# Altium project allaki_mezzanine.PrjPCB
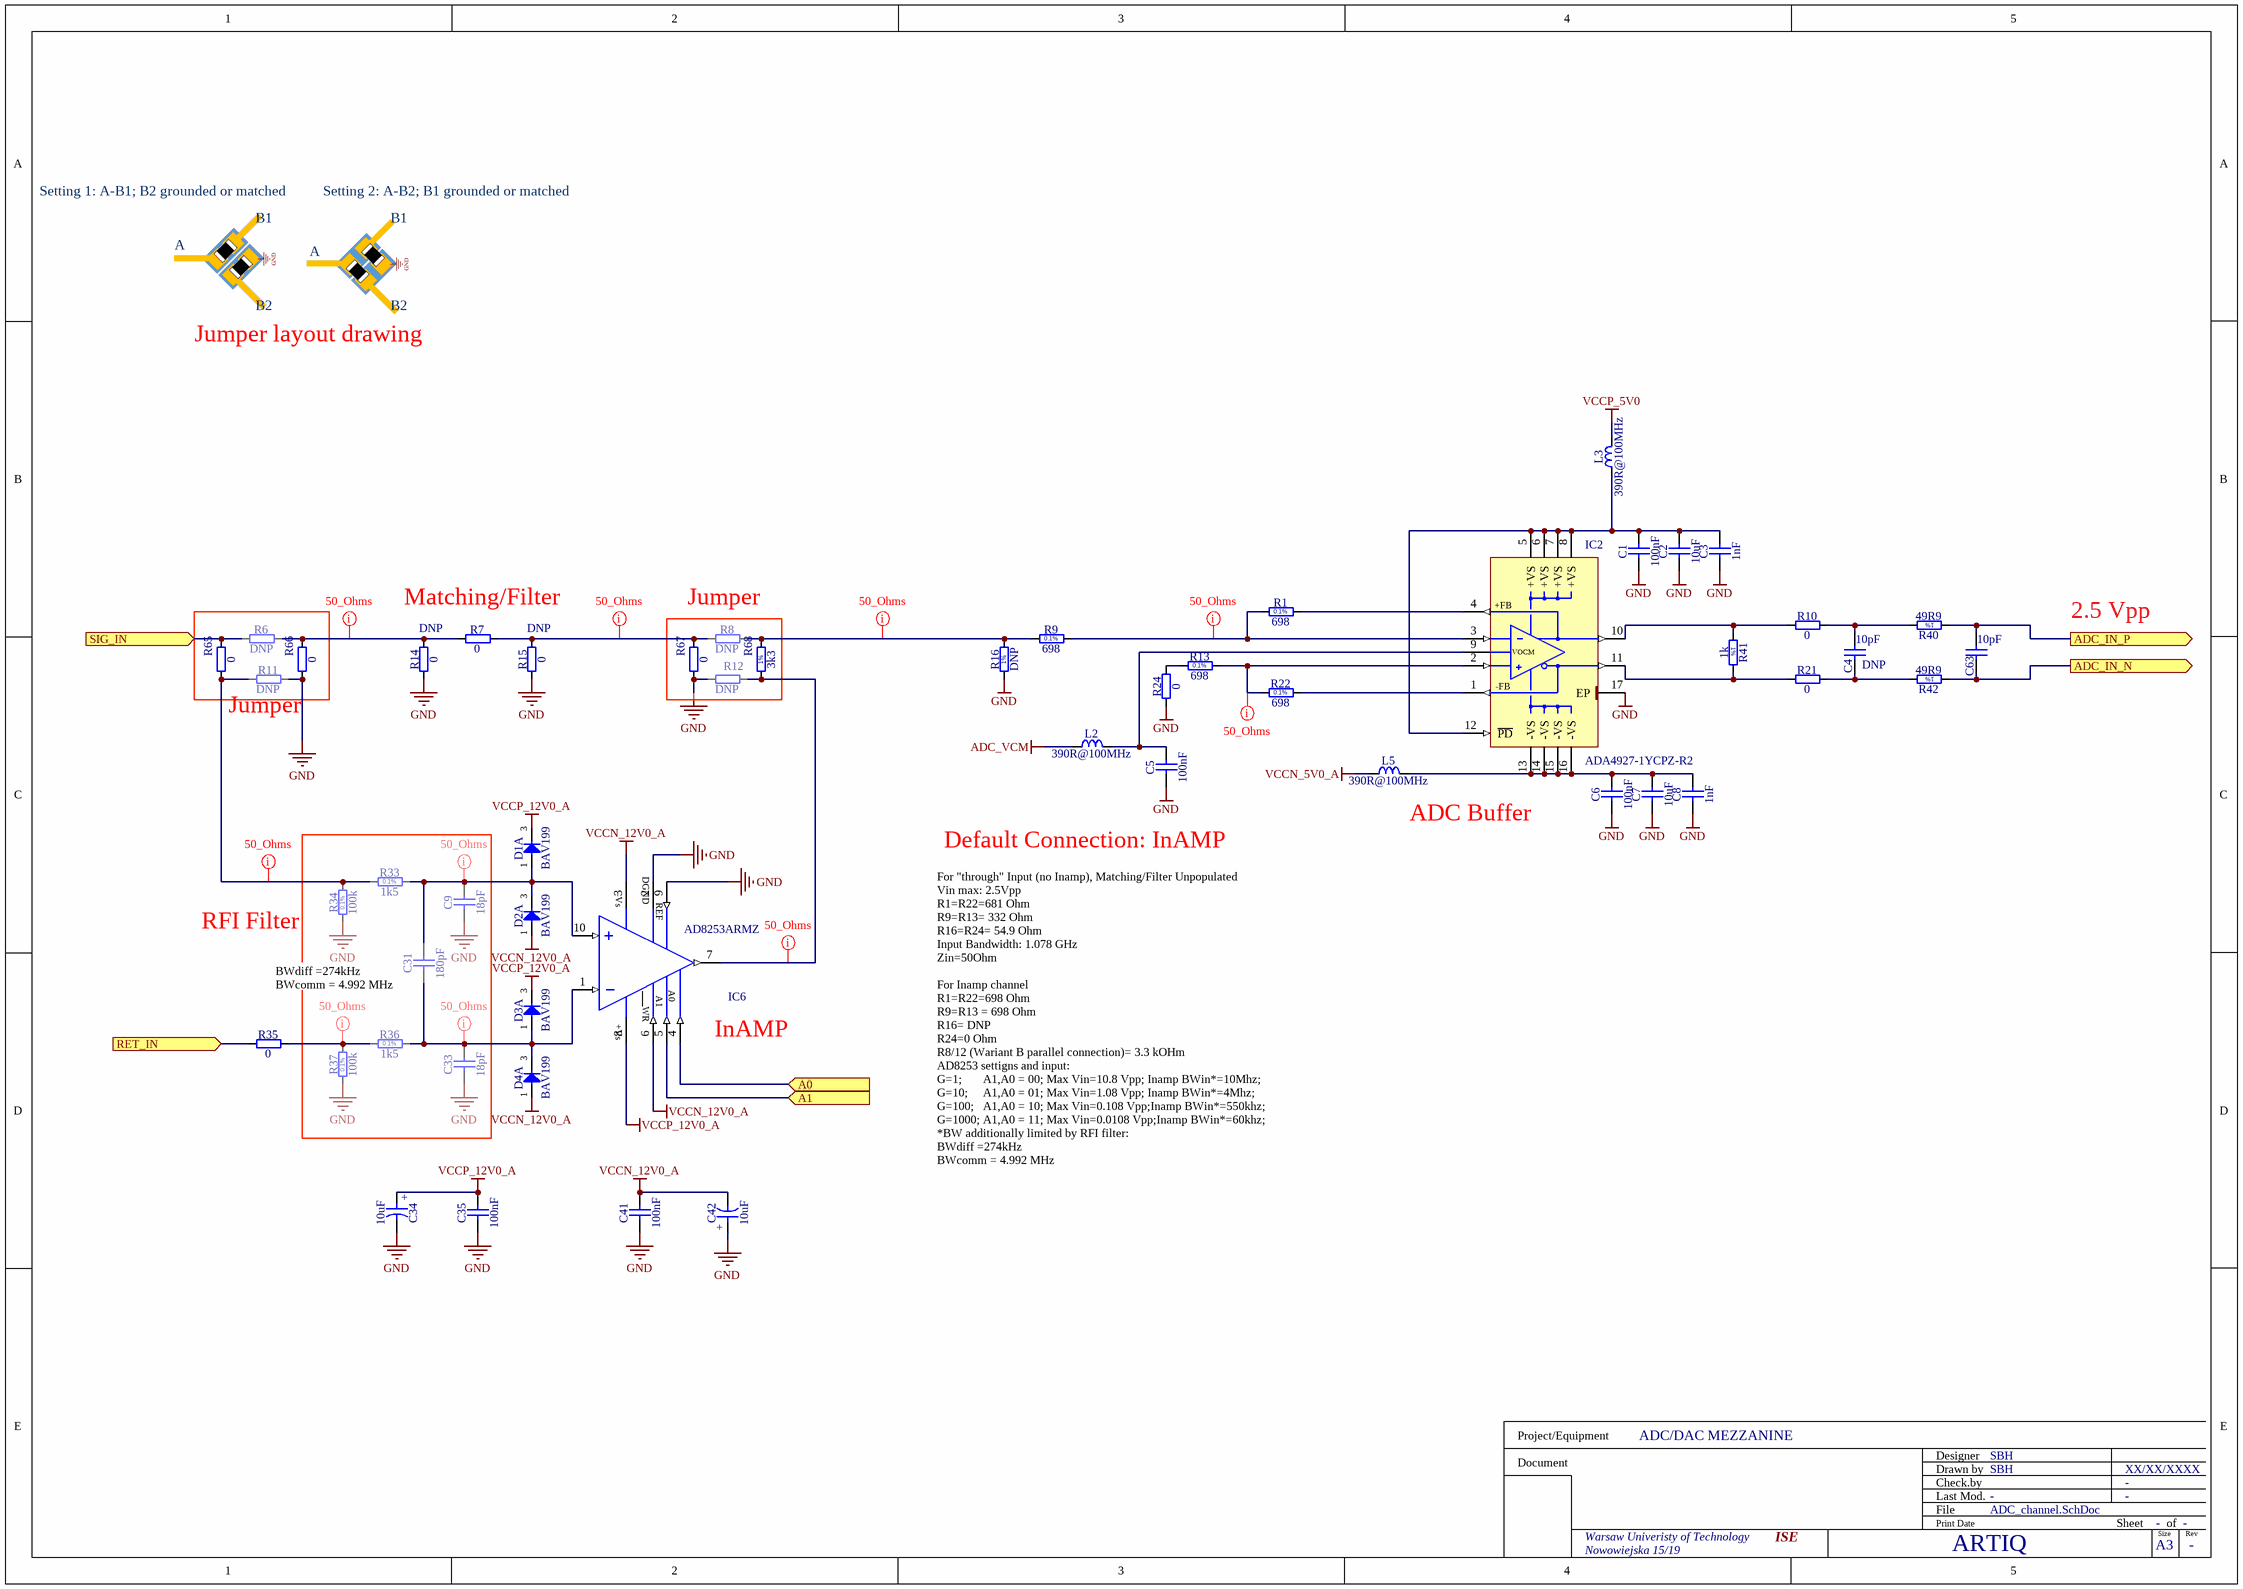
[diagram p0: ADC_channel.SchDoc]
3 sheets, 82 parts. Net scope: flat (ports and power ports of the same name join across sheets).
Board file: allaki_mezzanine.PcbDoc
Sheets:
  ADC_channel.SchDoc
  B2B_connectors .SchDoc
  PowerSupply.SchDoc

## Sheet ADC_channel.SchDoc: =ProjectName
size 420 x 297 mm; Author: SBH; CompanyName: WUT; DrawnBy: SBH; Organization: ISE-WUT; Address1: Warsaw Univeristy of Technology; Address2: Nowowiejska 15/19; Revision: -; SheetNumber: -; SheetTotal: -; EDA_Number: ARTIQ; Projet: ADC/DAC MEZZANINE; ModifiedBy: -; CreateDate: XX/XX/XXXX; CheckedDate: -; Title2: ADC_channel.SchDoc; DivGrp: ISE; Designer: SBH; ModifiedDate: -; ProjectName: ADC/DAC MEZZANINE

### Parts
C1  100nF  [CAPC1005X55N]
C2  10uF  [CAPC1608X87N]
C3  1nF  [CAPC1005X55N]
C4  10pF  Mounted: DNP  [CAPC1608X87N]
C5  100nF  [CAPC1005X55N]
C6  100nF  [CAPC1005X55N]
C7  10uF  [CAPC1608X87N]
C8  1nF  [CAPC1005X55N]
C9  18pF  [CAPC1005X55N]
C31  180pF  [CAPC3216X140N]
C33  18pF  [CAPC1005X55N]
C34  10uF  [CAPMP3216X180N]
C35  100nF  [CAPC1005X55N]
C41  100nF  [CAPC1005X55N]
C42  10uF  [CAPMP3216X180N]
C63  10pF  [CAPC1608X87N]
D1  BAV199  [SOT95P240X110-3N]  (part A of 2)
D2  BAV199  [SOT95P240X110-3N]  (part A of 2)
D3  BAV199  [SOT95P240X110-3N]  (part A of 2)
D4  BAV199  [SOT95P240X110-3N]  (part A of 2)
IC2  ADA4927-1YCPZ-R2  [QFN50P300X300X100-17N-S145]
IC6  AD8253ARMZ  [SOP50P490X110-10N]
L2  390R@100MHz  [INDC1608X95N]
L3  390R@100MHz  [INDC1608X95N]
L5  390R@100MHz  [INDC1608X95N]
R1  698  [RESC1608X55N]
R6  DNP  [RESC1005X40N]
R7  0  [RESC1005X40N]
R8  DNP  [RESC1005X40N]
R9  698  [RESC1608X55N]
R10  0  [RESC1005X40N]
R11  DNP  [RESC1005X40N]
R12  DNP  [RESC1005X40N]
R13  698  [RESC1608X55N]
R14  0  Mounted: DNP  [RESC1005X40N]
R15  0  Mounted: DNP  [RESC1005X40N]
R16  DNP  [RESC1005X40N]
R21  0  [RESC1005X40N]
R22  698  [RESC1608X55N]
R24  0  [RESC1005X40N]
R33  1k5  [RESC1608X55N]
R34  100k  [RESC1005X35N]
R35  0  [RESC1005X40N]
R36  1k5  [RESC1608X55N]
R37  100k  [RESC1005X35N]
R40  49R9  [RESC1005X40N]
R41  1k  [RESC1005X40N]
R42  49R9  [RESC1005X40N]
R65  0  [RESC1005X40N]
R66  0  [RESC1005X40N]
R67  0  [RESC1005X40N]
R68  3k3  [RESC1005X40N]

### Blocks framed on the sheet
Jumper: R8 R12 R67 R68

### Ports
A0 (in), A1 (in), ADC_IN_N (out), ADC_IN_P (out), RET_IN (in), SIG_IN (in)

### Nets
ADC_VCM: L2.1
GND: C1.1 C2.1 C3.1 C5.1 C6.1 C7.1 C8.1 C9.1 C33.1 C34.2 C35.1 C41.1 C42.1 IC2.17(EP) IC6.2(DGND) IC6.9(REF) R11.2 R12.2 R14.1 R15.1 R16.1 R24.1 R34.1 R37.1 R66.1 R67.1
VCCN_5V0_A: L5.1
VCCN_12V0_A: C41.2 C42.2 D2.1(A) D4.1(A) IC6.3(-VS) IC6.6(~{WR})
VCCP_5V0: L3.2
VCCP_12V0_A: C34.1 C35.2 D1.3(COMAC) D3.3(COMAC) IC6.8(+VS)
NetC1_2: C1.2 C2.2 C3.2 IC2.5(+VS) IC2.6(+VS) IC2.7(+VS) IC2.8(+VS) IC2.12(~{PD}) L3.1
NetC4_1: C4.1 R21.2 R42.2
NetC4_2: C4.2 R10.2 R40.2
NetC5_2: C5.2 IC2.9(VOCM) L2.2
NetC6_2: C6.2 C7.2 C8.2 IC2.13(-VS) IC2.14(-VS) IC2.15(-VS) IC2.16(-VS) L5.2
NetC9_2: C9.2 C31.2 D1.1(A) D2.3(COMAC) IC6.10(+IN) R33.2
NetC31_1: C31.1 C33.2 D3.1(A) D4.3(COMAC) IC6.1(-IN) R36.2
NetC63_1: C63.1 R42.1 ; port ADC_IN_N
NetC63_2: C63.2 R40.1 ; port ADC_IN_P
NetIC2_1: IC2.1(-FB) R22.2
NetIC2_2: IC2.2(+IN) R13.2 R22.1
NetIC2_3: IC2.3(-IN) R1.1 R9.2
NetIC2_4: IC2.4(+FB) R1.2
NetIC2_10: IC2.10(+OUT) R10.1 R41.1
NetIC2_11: IC2.11(-OUT) R21.1 R41.2
NetIC6_4: IC6.4(A0) ; port A0
NetIC6_5: IC6.5(A1) ; port A1
NetIC6_7: IC6.7(OUT) R12.1 R68.1
NetR6_1: R6.1 R65.2 ; port SIG_IN
NetR6_2: R6.2 R7.1 R14.2 R66.2
NetR7_2: R7.2 R8.2 R15.2 R67.2
NetR8_1: R8.1 R9.1 R16.2 R68.2
NetR11_1: R11.1 R33.1 R34.2 R65.1
NetR13_1: R13.1 R24.2
NetR35_1: R35.1 ; port RET_IN
NetR35_2: R35.2 R36.1 R37.2

### Layout directives
net class 50_Ohms: NetC9_2, NetC31_1, NetIC2_2, NetIC2_3, NetIC6_7, NetR6_2, NetR7_2, NetR8_1, NetR11_1, NetR35_2

### Notes on the sheet
- Setting 1: A-B1; B2 grounded or matched
- A
- B1
- Setting 2: A-B2; B1 grounded or matched
- B2
- Jumper layout drawing
- Matching/Filter
- 2.5 Vpp
- Jumper
- Default Connection: InAMP
- (near L5) ADC Buffer
- (near R34) RFI Filter
- (near C31) BWdiff =274kHz
  BWcomm = 4.992 MHz
- (near IC6) InAMP
- For "through" Input (no Inamp), Matching/Filter Unpopulated
  Vin max: 2.5Vpp
  R1=R22=681 Ohm
  R9=R13= 332 Ohm
  R16=R24= 54.9 Ohm
  Input Bandwidth: 1.078 GHz
  Zin=50Ohm
  For Inamp channel
  R1=R22=698 Ohm
  R9=R13 = 698 Ohm
  R16= DNP
  R24=0 Ohm
  R8/12 (Wariant B parallel connection)= 3.3 kOHm
  AD8253 settigns and input:
  G=1;       A1,A0 = 00; Max Vin=10.8 Vpp; Inamp BWin*=10Mhz;
  G=10;     A1,A0 = 01; Max Vin=1.08 Vpp; Inamp BWin*=4Mhz;
  G=100;   A1,A0 = 10; Max Vin=0.108 Vpp;Inamp BWin*=550khz;
  G=1000; A1,A0 = 11; Max Vin=0.0108 Vpp;Inamp BWin*=60khz;
  *BW additionally limited by RFI filter:
  BWdiff =274kHz
  BWcomm = 4.992 MHz
- Project/Equipment
- Document
- Designer
- Drawn by
- Check.by
- File
- Last Mod.
- Print Date
- Sheet
- Size
- A3
- of
- Rev
- (in symbol AD8253ARMZ) -Vs; WR; +Vs
- (in symbol CTE3216-18_10UF_16V_20%_AVX_TCJ) +
- (in symbol R0402_1K_1%_0.0625W_100PPM) 1%
- (in symbol R0402_3K3_1%_0.0625W_100PPM) 1%
- (in symbol R0402_49R9_1%_0.0625W_100PPM) 1%
- (in symbol R0402_56R_1%_0.0625W_100PPM) 1%
- (in symbol R0402_100K_0.1%_0.063W_25PPM) 0.1%
- (in symbol R0603_1K5_0.1%_0.063W_10PPM) 0.1%
- (in symbol R0603_698R_0.1%_0.063W_10PPM) 0.1%

### Library data of the parts
C1 C5 C6 = CC0402_100NF_16V_10%_X5R: Non-polarised capacitor; Part Description: SMD Multilayer Chip Ceramic Capacitor; Manufacturer: GENERIC; Manufacturer1 Part Number: GRM155R61C104KA88D; Voltage: 16V; TC: X5R; Tolerance: ±10%; Part Number: CC0402_100NF_16V_10%_X5R; Component Kind: Standard; Component Type: Standard; Pin Count: 2; Value: 100nF; Status: None; Manufacturer Part Number: CC0402_100NF_16V_10%_X5R; Case: 0402; Mounted: Yes; Socket: No; SMD: Yes; Sense: No; Manufacturer1 Example: MURATA; Manufacturer1 ComponentHeight: 0.55mm; HelpURL: \\cern.ch\dfs\Applications\Altium\Datasheets\CC0402_X5R_MURATA_GRM.pdf; Author: CERN DEM JLC; CreateDate: 10.12.2013; LatestRevisionDate: 10.12.2013
C2 C7 = CC0603_10UF_6.3V_20%_X5R: Non-polarised capacitor; Part Description: SMD Multilayer Chip Ceramic Capacitor; Manufacturer: GENERIC; Manufacturer1 Part Number: C0603C106M9PAC; Voltage: 6.3V; TC: X5R; Tolerance: ±20%; Part Number: CC0603_10UF_6.3V_20%_X5R; Component Kind: Standard; Component Type: Standard; Pin Count: 2; Value: 10uF; Status: Preferred; Manufacturer Part Number: CC0603_10uF_6.3V_20%_X5R; Case: 0603; Mounted: Yes; Socket: No; SMD: Yes; Sense: No; Manufacturer1 Example: KEMET; Manufacturer1 ComponentHeight: 0.95mm; HelpURL: \\cern.ch\dfs\Applications\Altium\Datasheets\CC0603_X5R_KEMET.pdf; Author: CERN DEM JLC; CreateDate: 03.12.2007; LatestRevisionDate: 03.12.2007
C3 C8 = CC0402_1NF_50V_10%_X7R: Non-polarised capacitor; Part Description: SMD Multilayer Chip Ceramic Capacitor; Manufacturer: GENERIC; Manufacturer1 Part Number: 223858715623; Voltage: 50V; TC: X7R; Tolerance: ±10%; Part Number: CC0402_1NF_50V_10%_X7R; Component Kind: Standard; Component Type: Standard; Pin Count: 2; Value: 1nF; Status: Not Recommended; Manufacturer Part Number: CC0402_1NF_50V_10%_X7R; Case: 0402; Mounted: Yes; Socket: No; SMD: Yes; Sense: No; Manufacturer1 Example: PHYCOMP; Manufacturer1 ComponentHeight: 0.55mm; HelpURL: \\cern.ch\dfs\Applications\Altium\Datasheets\CC0402_X7R_PHYCOMP.pdf; Author: CERN DEM JLC; CreateDate: 03.12.2007; LatestRevisionDate: 03.12.2007
C4 C63 = CC0603_10PF_50V_5%_NP0: Non-polarised capacitor; Part Description: SMD Multilayer Chip Ceramic Capacitor; Manufacturer: GENERIC; Manufacturer1 Part Number: 223886715109; Voltage: 50V; TC: C0G/NP0; Tolerance: ±5%; Part Number: CC0603_10PF_50V_5%_NP0; Component Kind: Standard; Component Type: Standard; Pin Count: 2; Value: 10pF; Status: Preferred; Manufacturer Part Number: CC0603_10PF_50V_5%_NP0; Case: 0603; Socket: No; SMD: Yes; Sense: No; Manufacturer1 Example: PHYCOMP; Manufacturer1 ComponentHeight: 0.87mm; HelpURL: \\cern.ch\dfs\Applications\Altium\Datasheets\CC0603_NP0_PHYCOMP.pdf; Author: CERN DEM JLC; CreateDate: 03.12.2007; LatestRevisionDate: 03.12.2007
  C63: Mounted: Yes
C9 C33 = CC0402_18PF_50V_5%_C0G: Non-polarised capacitor; Part Description: SMD Multilayer Chip Ceramic Capacitor; Manufacturer: GENERIC; Manufacturer1 Part Number: C0402C180J5GACTU; Voltage: 50V; TC: C0G/NP0; Tolerance: ±5%; Part Number: CC0402_18PF_50V_5%_C0G; Component Kind: Standard; Component Type: Standard; Pin Count: 2; Value: 18pF; Status: Preferred; Manufacturer Part Number: CC0402_18PF_50V_5%_C0G; Case: 0402; Mounted: Yes; Socket: No; SMD: Yes; Sense: No; Manufacturer1 Example: KEMET; Manufacturer1 ComponentHeight: 0.55mm; HelpURL: \\cern.ch\dfs\Applications\Altium\Datasheets\CC0805_C0G_KEMET_(Commercial Grade).pdf; Author: CERN DEM JLC; CreateDate: 2016-10-04; LatestRevisionDate: 2016-10-04
C31 = CC1206_180PF_50V_5%_NP0: Non-polarised capacitor; Part Description: SMD Multilayer Chip Ceramic Capacitor; Manufacturer: GENERIC; Manufacturer1 Part Number: VJ1206A181JXAAT; Voltage: 50V; TC: C0G/NP0; Tolerance: ±5%; Part Number: CC1206_180PF_50V_5%_NP0; Component Kind: Standard; Component Type: Standard; Pin Count: 2; Value: 180pF; Status: Preferred; Manufacturer Part Number: CC1206_180PF_50V_5%_NP0; Case: 1206; Mounted: Yes; Socket: No; SMD: Yes; Sense: No; Manufacturer1 Example: VISHAY VITRAMON; Manufacturer1 ComponentHeight: 1.7mm; HelpURL: \\cern.ch\dfs\Applications\Altium\Datasheets\CC1206_NP0_VISHAY_VJ.pdf; Author: CERN DEM JLC; CreateDate: 2007-12-03; LatestRevisionDate: 2007-12-03
C34 C42 = CTE3216-18_10UF_16V_20%_AVX_TCJ: Polarised capacitor; Part Description: ESR 0R200 Tantalum Solid Electrolytic Chip Capacitor with Conductive Polymer Electrode; Manufacturer: AVX; Manufacturer Part Number: TCJA106M016R0200; Voltage: 16V; Tolerance: ±20%; Part Number: CTE3216-18_10UF_16V_20%_AVX_TCJ; Component Kind: Standard; Component Type: Standard; Pin Count: 2; Value: 10uF; Status: Preferred; Case: A; Mounted: Yes; Socket: No; SMD: Yes; Sense: No; HelpURL: \\cern.ch\dfs\Applications\Altium\Datasheets\CTE_AVX_TCJ.pdf; Author: CERN DEM JLC; CreateDate: 2012-03-29; LatestRevisionDate: 2012-03-29; ComponentHeight: 1.8mm
C35 C41 = CC0402_100NF_16V_10%_X7R: Non-polarised capacitor; Part Description: SMD Multilayer Chip Ceramic Capacitor; Manufacturer: GENERIC; Manufacturer1 Part Number: GRM155R71C104KA88D; Voltage: 16V; TC: X7R; Tolerance: ±10%; Part Number: CC0402_100NF_16V_10%_X7R; Component Kind: Standard; Component Type: Standard; Pin Count: 2; Value: 100nF; Status: Not Recommended; Manufacturer Part Number: CC0402_100NF_16V_10%_X7R; Case: 0402; Mounted: Yes; Socket: No; SMD: Yes; Sense: No; Manufacturer1 Example: MURATA; Manufacturer1 ComponentHeight: 0.55mm; HelpURL: \\cern.ch\dfs\Applications\Altium\Datasheets\CC0402_X7R_MURATA_GRM.pdf; Author: CERN DEM JLC; CreateDate: 2013-12-05; LatestRevisionDate: 2007-12-03
D1-D4 = BAV199: Serial Diode; Part Description: Low-Leakage Double Diode; Manufacturer: NXP SEMICONDUCTORS; Voltage: 75V; Power: 250mW; PressFit: No; Bonding: No; Part Number: BAV199; Component Kind: Standard; Component Type: Standard; Device: BAV199; PackageDescription: SOT23 3-Leads, Pitch 0.95mm - Body 1.4x3mm, IPC Medium Density; Manufacturer Part Number: BAV199; Pin Count: 3; Case: SOT23-3; Mounted: Yes; Socket: No; SMD: Yes; Sense: No; ComponentHeight: 1.1mm; HelpURL: \\cern.ch\dfs\Applications\Altium\Datasheets\BAV199.pdf; Author: CERN DEM JMW; CreateDate: 2008-11-21; LatestRevisionDate: 2008-11-21
IC2 = ADA4927-1YCPZ-R2: Ultralow Distortion Current Feedback Differential ADC Driver; Manufacturer: ANALOG DEVICES; PressFit: No; Bonding: No; Part Number: ADA4927-1YCPZ-R2; Component Kind: Standard; Component Type: Standard; Device: ADA4927-1YCPZ-R2; PackageDescription: QFN,0.50mm pitch,square; 4 pin X 4 pin, 3mm X 3mm X 1.00mm H body (w/thermal tab 1.45 X 1.45mm),  IPC Medium Density; Part Description: Ultralow Distortion Current Feedback Differential ADC Driver; Manufacturer Part Number: ADA4927-1YCPZ-R2; Pin Count: 17; Case: QFN16; Mounted: Yes; Socket: No; SMD: Yes; Sense: No; ComponentHeight: 1mm; Author: CERN DEM JLC; HelpURL: \\cern.ch\dfs\Applications\Altium\Datasheets\ADA4927-1YCPZ-R2.pdf; CreateDate: 19.04.2010; LatestRevisionDate: 19.04.2010
IC6 = AD8253ARMZ: 10MHz, 20V/us, G= 1, 10, 100, 1000 iCMOS Programmable Gain Instrumentation Amplifier; Manufacturer: ANALOG DEVICES; PressFit: No; Bonding: No; Part Number: AD8253ARMZ; Component Kind: Standard; Component Type: Standard; Device: AD8253ARMZ; PackageDescription: MSOP, 10-Leads, Body 3.1x3.1mm (max), Pitch 0.50mm, IPC Medium Density; Part Description: 10MHz, 20V/us, G= 1, 10, 100, 1000 iCMOS Programmable Gain Instrumentation Amplifier; Manufacturer Part Number: AD8253ARMZ; Pin Count: 8; Case: MSOP10; Mounted: Yes; Socket: No; SMD: Yes; Sense: No; ComponentHeight: 1.1mm; Author: CERN DEM JLC; HelpURL: \\cern.ch\dfs\Applications\Altium\Datasheets\AD8253ARMZ.pdf; CreateDate: 2013-10-02; LatestRevisionDate: 2013-10-02
L2 L3 L5 = IND0603_TDK_MPZ1608R391A: Inductor; Part Description: SMT Chip Bead for Power Line; Manufacturer: TDK; Power: 1.2A; Resistance: 0.12R; Tolerance: ±25%; Part Number: IND0603_TDK_MPZ1608R391A; Component Kind: Standard; Component Type: Standard; Pin Count: 2; Value: 390R@100MHz; Status: None; Manufacturer Part Number: MPZ1608R391A; Case: 0603; Mounted: Yes; Socket: No; SMD: Yes; Sense: No; ComponentHeight: 0.95mm; HelpURL: \\cern.ch\dfs\Applications\Altium\Datasheets\IND0603_TDK_MPZ1608.pdf; Author: CERN DEM JLC; CreateDate: 2009-12-02; LatestRevisionDate: 2009-12-02
R1 R9 R13 R22 = R0603_698R_0.1%_0.063W_10PPM: Resistor - 0.1%; Part Description: Thin Film Chip Resistor; Manufacturer: GENERIC; Manufacturer1 Part Number: RN73C1J698RBTDF; Power: 0.063W; TC: ±10ppm; Part Number: R0603_698R_0.1%_0.063W_10PPM; Component Kind: Standard; Component Type: Standard; Pin Count: 2; Value: 698; Status: Not recommended; Tolerance: ±0.1%; Manufacturer Part Number: R0603_698R_0.1%_0.063W_10PPM; Case: 0603; Mounted: Yes; Sense: No; Socket: No; SMD: Yes; Manufacturer1 Example: TYCO HOLSWORTHY; Manufacturer1 ComponentHeight: 0.5mm; HelpURL: \\cern.ch\dfs\Applications\Altium\Datasheets\R0603_Tyco_RN73.pdf; Author: CERN DEM JLC; CreateDate: 2007-12-03; LatestRevisionDate: 2008-03-13
R6 R8 R11 R12 = R0402_0R_JUMPER: Resistor; Part Description: 1A (0.05R Max DC Resistance) Zero Ohm Jumper; Manufacturer: GENERIC; Manufacturer1 Part Number: 232270591001L; Value: 0; Mounted: DNP; Part Number: R0402_0R_JUMPER; Component Kind: Standard; Component Type: Standard; Pin Count: 2; Status: Not recommended; Manufacturer Part Number: R0402_0R_JUMPER; Case: 0402; Sense: No; Socket: No; SMD: Yes; Manufacturer1 Example: YAGEO PHYCOMP; Manufacturer1 ComponentHeight: 0.4mm; HelpURL: \\cern.ch\dfs\Applications\Altium\Datasheets\R0402_Phycomp_RC0402.pdf; Author: CERN DEM JLC; CreateDate: 2007-12-03; LatestRevisionDate: 2012-10-17
R7 R10 R14 R15 R21 R24 R35 R65-R67 = R0402_0R_JUMPER: Resistor; Part Description: 1A (0.05R Max DC Resistance) Zero Ohm Jumper; Manufacturer: GENERIC; Manufacturer1 Part Number: 232270591001L; Part Number: R0402_0R_JUMPER; Component Kind: Standard; Component Type: Standard; Pin Count: 2; Value: 0; Status: Not recommended; Manufacturer Part Number: R0402_0R_JUMPER; Case: 0402; Sense: No; Socket: No; SMD: Yes; Manufacturer1 Example: YAGEO PHYCOMP; Manufacturer1 ComponentHeight: 0.4mm; HelpURL: \\cern.ch\dfs\Applications\Altium\Datasheets\R0402_Phycomp_RC0402.pdf; Author: CERN DEM JLC; CreateDate: 2007-12-03; LatestRevisionDate: 2012-10-17
  R7 R10 R21 R24 R35 R65-R67: Mounted: Yes
R16 = R0402_56R_1%_0.0625W_100PPM: Resistor - 1%; Part Description: General Purpose Thick Film Chip Resistor; Manufacturer: GENERIC; Manufacturer1 Part Number: 232270675609L; Value: 56; TC: ±100ppm/°C; Mounted: DNP; Part Number: R0402_56R_1%_0.0625W_100PPM; Component Kind: Standard; Component Type: Standard; Pin Count: 2; Status: Not recommended; Power: 0.0625W; Tolerance: ±1%; Manufacturer Part Number: R0402_56R_1%_0.0625W_100PPM; Case: 0402; Sense: No; Socket: No; SMD: Yes; Manufacturer1 Example: YAGEO PHYCOMP; Manufacturer1 ComponentHeight: 0.4mm; HelpURL: \\cern.ch\dfs\Applications\Altium\Datasheets\R0402_Phycomp_RC0402.pdf; Author: CERN DEM JLC; CreateDate: 03.12.2007; LatestRevisionDate: 17.10.2012
R33 R36 = R0603_1K5_0.1%_0.063W_10PPM: Resistor - 0.1%; Part Description: Thin Film Chip Resistor; Manufacturer: GENERIC; Manufacturer1 Part Number: RN73C1J1K5BTDF; Power: 0.063W; TC: ±10ppm; Part Number: R0603_1K5_0.1%_0.063W_10PPM; Component Kind: Standard; Component Type: Standard; Pin Count: 2; Value: 1k5; Status: Not recommended; Tolerance: ±0.1%; Manufacturer Part Number: R0603_1K5_0.1%_0.063W_10PPM; Case: 0603; Mounted: Yes; Sense: No; Socket: No; SMD: Yes; Manufacturer1 Example: TYCO HOLSWORTHY; Manufacturer1 ComponentHeight: 0.5mm; HelpURL: \\cern.ch\dfs\Applications\Altium\Datasheets\R0603_Tyco_RN73.pdf; Author: CERN DEM JLC; CreateDate: 2007-12-03; LatestRevisionDate: 2008-03-13
R34 R37 = R0402_100K_0.1%_0.063W_25PPM: Resistor - 0.1%; Part Description: Thin Film Precision Resistor; Manufacturer: GENERIC; Manufacturer1 Part Number: CPF0402B100KE1; Power: 0.063W; TC: ±25ppm/°C; Part Number: R0402_100K_0.1%_0.063W_25PPM; Component Kind: Standard; Component Type: Standard; Pin Count: 2; Value: 100k; Status: Not Recommended; Tolerance: ±0.1%; Manufacturer Part Number: R0402_100K_0.1%_0.063W_25PPM; Case: 0402; Mounted: Yes; Sense: No; Socket: No; SMD: Yes; Manufacturer1 Example: TE CONNECTIVITY; Manufacturer1 ComponentHeight: 0.35mm; HelpURL: \\cern.ch\dfs\Applications\Altium\Datasheets\R0402_TYCO_CPF.pdf; Author: CERN DEM JMW; CreateDate: 2015-09-22; LatestRevisionDate: 2015-09-22
R40 R42 = R0402_49R9_1%_0.0625W_100PPM: Resistor - 1%; Part Description: General Purpose Thick Film Chip Resistor; Manufacturer: GENERIC; Manufacturer1 Part Number: 232270674999L or RC0402FR-0749R9L; TC: ±100ppm/°C; Part Number: R0402_49R9_1%_0.0625W_100PPM; Component Kind: Standard; Component Type: Standard; Pin Count: 2; Value: 49R9; Status: Not recommended; Power: 0.0625W; Tolerance: ±1%; Manufacturer Part Number: R0402_49R9_1%_0.0625W_100PPM; Case: 0402; Mounted: Yes; Sense: No; Socket: No; SMD: Yes; Manufacturer1 Example: YAGEO PHYCOMP; Manufacturer1 ComponentHeight: 0.4mm; HelpURL: \\cern.ch\dfs\Applications\Altium\Datasheets\R0402_Phycomp_RC0402.pdf; Author: CERN DEM JLC; CreateDate: 24.10.2012; LatestRevisionDate: 24.10.2012
R41 = R0402_1K_1%_0.0625W_100PPM: Resistor - 1%; Part Description: General Purpose Thick Film Chip Resistor; Manufacturer: GENERIC; Manufacturer1 Part Number: 232270671002L; TC: ±100ppm/°C; Part Number: R0402_1K_1%_0.0625W_100PPM; Component Kind: Standard; Component Type: Standard; Pin Count: 2; Value: 1k; Status: Not recommended; Power: 0.0625W; Tolerance: ±1%; Manufacturer Part Number: R0402_1K_1%_0.0625W_100PPM; Case: 0402; Mounted: Yes; Sense: No; Socket: No; SMD: Yes; Manufacturer1 Example: YAGEO PHYCOMP; Manufacturer1 ComponentHeight: 0.4mm; HelpURL: \\cern.ch\dfs\Applications\Altium\Datasheets\R0402_Phycomp_RC0402.pdf; Author: CERN DEM JLC; CreateDate: 2007-12-03; LatestRevisionDate: 2012-10-17
R68 = R0402_3K3_1%_0.0625W_100PPM: Resistor - 1%; Part Description: General Purpose Thick Film Chip Resistor; Manufacturer: GENERIC; Manufacturer1 Part Number: 232270673302L; TC: ±100ppm/°C; Part Number: R0402_3K3_1%_0.0625W_100PPM; Component Kind: Standard; Component Type: Standard; Pin Count: 2; Value: 3k3; Status: Not recommended; Manufacturer Part Number: R0402_3K3_1%_0.0625W_100PPM; Case: 0402; Mounted: Yes; Sense: No; Socket: No; SMD: Yes; Manufacturer1 Example: YAGEO PHYCOMP; Manufacturer1 ComponentHeight: 0.4mm; HelpURL: \\cern.ch\dfs\Applications\Altium\Datasheets\R0402_Phycomp_RC0402.pdf; Author: CERN DEM JLC; CreateDate: 2007-12-03; LatestRevisionDate: 2012-10-17; Power: 0.0625W; Tolerance: ±1%

## Sheet B2B_connectors .SchDoc: =ProjectName
size 420 x 297 mm; Author: SBH; CompanyName: WUT; DrawnBy: SBH; Organization: ISE-WUT; Address1: Warsaw Univeristy of Technology; Address2: Nowowiejska 15/19; Revision: -; SheetNumber: -; SheetTotal: -; EDA_Number: ARTIQ; Projet: ADC/DAC MEZZANINE; ModifiedBy: -; CreateDate: XX/XX/XXXX; CheckedDate: -; Title2: B2B_connectors .SchDoc; DivGrp: ISE; Designer: SBH; ModifiedDate: -; ProjectName: ADC/DAC MEZZANINE
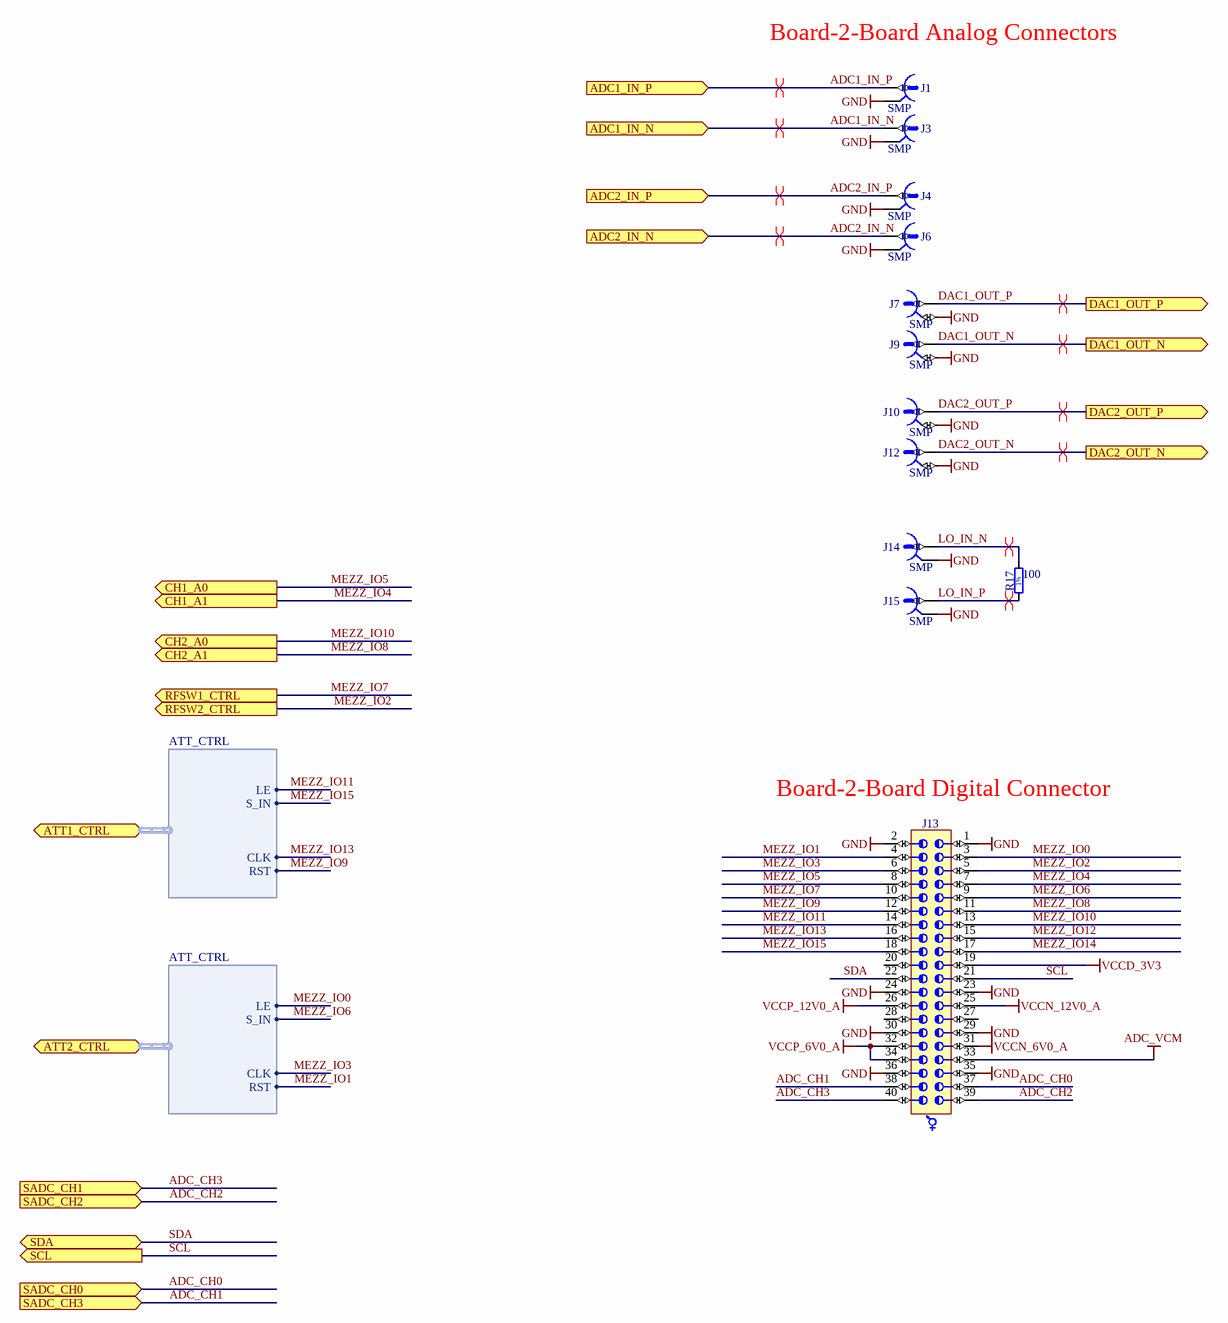
[diagram p1: B2B_connectors .SchDoc]

### Parts
J1  SMP  [AMPHENOL_SMP-MSLD-PCT-10]
J3  SMP  [AMPHENOL_SMP-MSLD-PCT-10]
J4  SMP  [AMPHENOL_SMP-MSLD-PCT-10]
J6  SMP  [AMPHENOL_SMP-MSLD-PCT-10]
J7  SMP  [MOLEX_85305-0232]
J9  SMP  [MOLEX_85305-0232]
J10  SMP  [MOLEX_85305-0232]
J12  SMP  [MOLEX_85305-0232]
J13  (no value)  [SAMTEC_LSS-120-02-L-DV-A]
J14  SMP  [AMPHENOL_SMP-MSLD-PCT-10]
J15  SMP  [AMPHENOL_SMP-MSLD-PCT-10]
R17  100  [RESC1005X40N]

### Ports
ADC1_IN_N (in), ADC1_IN_P (in), ADC2_IN_N (in), ADC2_IN_P (in), ATT1_CTRL (harness ATT_CTRL), ATT2_CTRL (harness ATT_CTRL), CH1_A0 (out), CH1_A1 (out), CH2_A0 (out), CH2_A1 (out), DAC1_OUT_N (out), DAC1_OUT_P (out), DAC2_OUT_N (out), DAC2_OUT_P (out), RFSW1_CTRL (out), RFSW2_CTRL (out), SADC_CH0 (in), SADC_CH1 (in), SADC_CH2 (in), SADC_CH3 (in), SCL (out), SDA (bidir)

### Harnesses
ATT_CTRL: LE, S_IN, CLK, RST

### Nets
ADC_VCM: J13.33
GND: J1.2 J3.2 J4.2 J6.2 J7.2 J9.2 J10.2 J12.2 J13.1 J13.2 J13.23 J13.24 J13.29 J13.30 J13.35 J13.36 J14.2 J15.2
VCCD_3V3: J13.19
VCCN_6V0_A: J13.31
VCCN_12V0_A: J13.25
VCCP_6V0_A: J13.32 J13.34
VCCP_12V0_A: J13.26
ADC1_IN_N: J3.1 ; port ADC1_IN_N
ADC1_IN_P: J1.1 ; port ADC1_IN_P
ADC2_IN_N: J6.1 ; port ADC2_IN_N
ADC2_IN_P: J4.1 ; port ADC2_IN_P
ADC_CH0: J13.37 ; port SADC_CH0
ADC_CH1: J13.38 ; port SADC_CH3
ADC_CH2: J13.39 ; port SADC_CH2
ADC_CH3: J13.40 ; port SADC_CH1
DAC1_OUT_N: J9.1 ; port DAC1_OUT_N
DAC1_OUT_P: J7.1 ; port DAC1_OUT_P
DAC2_OUT_N: J12.1 ; port DAC2_OUT_N
DAC2_OUT_P: J10.1 ; port DAC2_OUT_P
LO_IN_N: J14.1 R17.2
LO_IN_P: J15.1 R17.1
MEZZ_IO0: J13.3 ; port ATT2_CTRL.LE
MEZZ_IO1: J13.4 ; port ATT2_CTRL.RST
MEZZ_IO2: J13.5 ; port RFSW2_CTRL
MEZZ_IO3: J13.6 ; port ATT2_CTRL.CLK
MEZZ_IO4: J13.7 ; port CH1_A1
MEZZ_IO5: J13.8 ; port CH1_A0
MEZZ_IO6: J13.9 ; port ATT2_CTRL.S_IN
MEZZ_IO7: J13.10 ; port RFSW1_CTRL
MEZZ_IO8: J13.11 ; port CH2_A1
MEZZ_IO9: J13.12 ; port ATT1_CTRL.RST
MEZZ_IO10: J13.13 ; port CH2_A0
MEZZ_IO11: J13.14 ; port ATT1_CTRL.LE
MEZZ_IO12: J13.15
MEZZ_IO13: J13.16 ; port ATT1_CTRL.CLK
MEZZ_IO14: J13.17
MEZZ_IO15: J13.18 ; port ATT1_CTRL.S_IN
SCL: J13.21 ; port SCL
SDA: J13.22 ; port SDA

Not connected (* = marked no-connect by the designer): J13 20 27 28

### Layout directives
differential pair: ADC1_IN_N, ADC1_IN_P, ADC2_IN_N, ADC2_IN_P, DAC1_OUT_N, DAC1_OUT_P, DAC2_OUT_N, DAC2_OUT_P, LO_IN_N, LO_IN_P

### Notes on the sheet
- (near J1) Board-2-Board Analog Connectors
- (near J13) Board-2-Board Digital Connector
- Project/Equipment
- Document
- Designer
- Drawn by
- Check.by
- File
- Last Mod.
- Print Date
- Sheet
- Size
- A3
- of
- Rev
- (in symbol R0402_100R_1%_0.0625W_100PPM) 1%

### Library data of the parts
J1 J3 J4 J6 J14 J15 = CON_SMP-MSLD-PCT-10: 50 Ohms, SMP Surface/THT Mount Plug, Limited Detent; Part Description: 50 Ohms, SMP Surface Mount Plug, Limited Detent; Manufacturer: AMPHENOL; PressFit: No; Part Number: AMPHENOL_SMP-MSLD-PCT-10; Component Kind: Standard; Component Type: Standard; Pin Count: 2; Family: SMP; Mounted: Yes; Socket: No; SMD: No; Sense: No; Status: None; Manufacturer Part Number: SMP-MSLD-PCT-10; ComponentHeight: 4.1mm; HelpURL: \\cern.ch\dfs\Applications\Altium\Datasheets\MOLEX_85305-0232.pdf; Author: GK; CreateDate: 11.11.2016; LatestRevisionDate: 11.11.2016
J7 J9 J10 J12 = MOLEX_85305-0232: Part Description: 50 Ohms, SMP Surface Mount Plug, Limited Detent; Manufacturer: MOLEX; PressFit: No; Part Number: MOLEX_85305-0232; Component Kind: Standard; Component Type: Standard; Pin Count: 2; Family: SMP; Mounted: Yes; Socket: No; SMD: Yes; Sense: No; Status: None; Manufacturer Part Number: 85305-0232; ComponentHeight: 4.1mm; HelpURL: \\cern.ch\dfs\Applications\Altium\Datasheets\MOLEX_85305-0232.pdf; Author: CERN DEM JMW; CreateDate: 09.08.2016; LatestRevisionDate: 09.08.2016
J13 = CON_SAMTEC_LSS-120-02-L-DV-A: 40 Contacts, Pitch 0.635mm, Razor Beam LSS Vertical High Speed Hermaphroditic Strip (Lead Style 7.49mm); Part Description: 40 Contacts, Pitch 0.635mm, Razor Beam LSS Vertical High Speed Hermaphroditic Strip (Lead Style 5.49mm); Manufacturer: SAMTEC; PressFit: No; Part Number: SAMTEC_LSS-120-02-L-DV-A; Component Kind: Standard; Component Type: Standard; Pin Count: 40; Mounted: Yes; Socket: No; Sense: No; SMD: Yes; Status: None; Manufacturer Part Number: LSS-120-02-L-DV-A; ComponentHeight: 5.57mm; HelpURL: \\cern.ch\dfs\Applications\Altium\Datasheets\SAMTEC_LSS-120-03-L-DV-A.pdf; Author: CERN DEM JMW; CreateDate: 10.11.2015; LatestRevisionDate: 10.11.2015
R17 = R0402_100R_1%_0.0625W_100PPM: Resistor - 1%; Part Description: General Purpose Thick Film Chip Resistor; Manufacturer: GENERIC; Manufacturer1 Part Number: 232270671001L; TC: ±100ppm/°C; Part Number: R0402_100R_1%_0.0625W_100PPM; Component Kind: Standard; Component Type: Standard; Pin Count: 2; Value: 100; Status: Not recommended; Power: 0.0625W; Tolerance: ±1%; Manufacturer Part Number: R0402_100R_1%_0.0625W_100PPM; Case: 0402; Mounted: Yes; Sense: No; Socket: No; SMD: Yes; Manufacturer1 Example: YAGEO PHYCOMP; Manufacturer1 ComponentHeight: 0.4mm; HelpURL: \\cern.ch\dfs\Applications\Altium\Datasheets\R0402_Phycomp_RC0402.pdf; Author: CERN DEM JLC; CreateDate: 03.12.2007; LatestRevisionDate: 17.10.2012

## Sheet PowerSupply.SchDoc: =ProjectName
size 420 x 297 mm; Author: SBH; CompanyName: WUT; DrawnBy: SBH; Organization: ISE-WUT; Address1: Warsaw Univeristy of Technology; Address2: Nowowiejska 15/19; Revision: -; SheetNumber: -; SheetTotal: -; EDA_Number: ARTIQ; Projet: ADC/DAC MEZZANINE; ModifiedBy: -; CreateDate: XX/XX/XXXX; CheckedDate: -; Title2: PowerSupply.SchDoc; DivGrp: ISE; Designer: SBH; ModifiedDate: -; ProjectName: ADC/DAC MEZZANINE
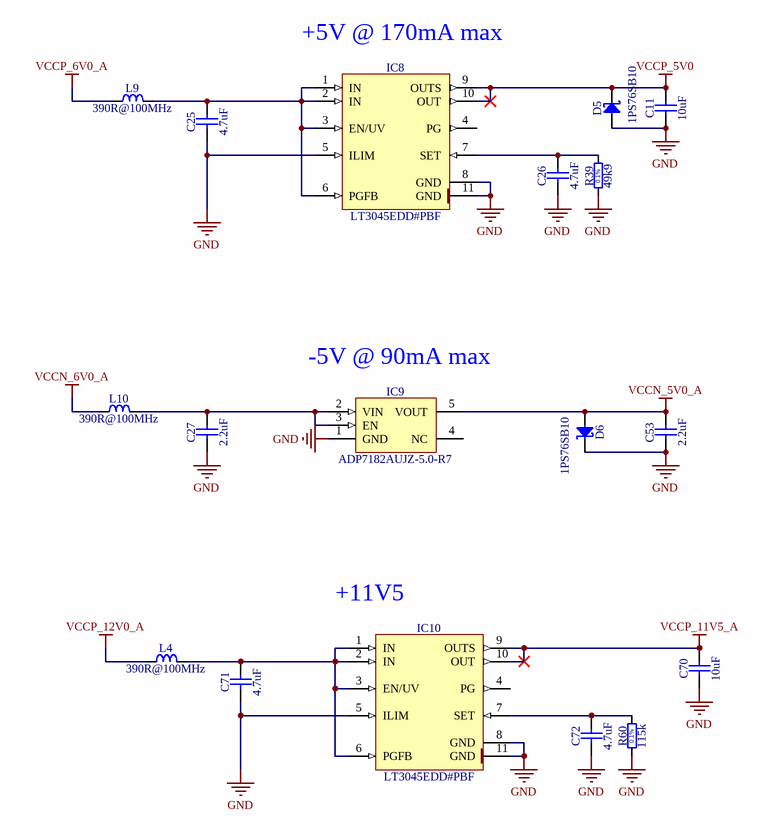
[diagram p2: PowerSupply.SchDoc]

### Parts
C11  10uF  [CAPC1608X87N]
C25  4.7uF  [CAPC1709X95N]
C26  4.7uF  [CAPC1709X95N]
C27  2.2uF  [CAPC1608X90N]
C53  2.2uF  [CAPC1608X90N]
C70  10uF  [CAPC1608X87N]
C71  4.7uF  [CAPC1709X95N]
C72  4.7uF  [CAPC1709X95N]
D5  1PS76SB10  [SOD2512X110N]
D6  1PS76SB10  [SOD2512X110N]
IC8  LT3045EDD#PBF  [SON50P300X300X80-11N-R175X248]
IC9  ADP7182AUJZ-5.0-R7  [SOT95P280X90-5N]
IC10  LT3045EDD#PBF  [SON50P300X300X80-11N-R175X248]
L4  390R@100MHz  [INDC1608X95N]
L9  390R@100MHz  [INDC1608X95N]
L10  390R@100MHz  [INDC1608X95N]
R39  49k9  [RESC1608X55N]
R60  115k  [RESC1608X55N]

### Nets
GND: C11.1 C25.1 C26.1 C27.1 C53.1 C70.1 C71.1 C72.1 D5.2(A) D6.1(C) IC8.5(ILIM) IC8.8(GND) IC8.11(GND) IC9.1(GND) IC10.5(ILIM) IC10.8(GND) IC10.11(GND) R39.1 R60.1
VCCN_5V0_A: C53.2 D6.2(A) IC9.5(VOUT)
VCCN_6V0_A: L10.1
VCCP_5V0: C11.2 D5.1(C) IC8.9(OUTS) IC8.10(OUT)
VCCP_6V0_A: L9.1
VCCP_11V5_A: C70.2 IC10.9(OUTS) IC10.10(OUT)
VCCP_12V0_A: L4.1
NetC25_2: C25.2 IC8.1(IN) IC8.2(IN) IC8.3(EN/UV) IC8.6(PGFB) L9.2
NetC26_2: C26.2 IC8.7(SET) R39.2
NetC27_2: C27.2 IC9.2(VIN) IC9.3(EN) L10.2
NetC71_2: C71.2 IC10.1(IN) IC10.2(IN) IC10.3(EN/UV) IC10.6(PGFB) L4.2
NetC72_2: C72.2 IC10.7(SET) R60.2

Not connected (* = marked no-connect by the designer): IC8 4(PG); IC9 4(NC); IC10 4(PG)

### Notes on the sheet
- (near IC8) +5V @ 170mA max
- (near IC9) -5V @ 90mA max
- (near IC10) +11V5
- Project/Equipment
- Document
- Designer
- Drawn by
- Check.by
- File
- Last Mod.
- Print Date
- Sheet
- Size
- A3
- of
- Rev
- (in symbol R0603_49K9_0.1%_0.063W_10PPM) 0.1%
- (in symbol R0603_115K_0.1%_0.063W_10PPM) 0.1%

### Library data of the parts
C11 C70 = CC0603_10UF_6.3V_20%_X5R: as C2 on sheet ADC_channel; Part Number: CC0603_10UF_6.3V_20%_X5R; Component Kind: Standard; Component Type: Standard; Pin Count: 2; Value: 10uF; Status: Preferred; Manufacturer Part Number: CC0603_10uF_6.3V_20%_X5R; Case: 0603; Mounted: Yes; Socket: No; SMD: Yes; Sense: No; Manufacturer1 Example: KEMET; Manufacturer1 ComponentHeight: 0.95mm; HelpURL: \\cern.ch\dfs\Applications\Altium\Datasheets\CC0603_X5R_KEMET.pdf; Author: CERN DEM JLC; CreateDate: 2007-12-03; LatestRevisionDate: 2007-12-03
C25 C26 C71 C72 = CC0603_4.7UF_16V_10%_X5R: Non-polarised capacitor; Part Description: SMD Multilayer Chip Ceramic Capacitor; Manufacturer: GENERIC; Manufacturer1 Part Number: EMK107ABJ475KA-T; Voltage: 16V; TC: X5R; Tolerance: ±10%; Part Number: CC0603_4.7UF_16V_10%_X5R; Component Kind: Standard; Component Type: Standard; Pin Count: 2; Value: 4.7uF; Status: None; Manufacturer Part Number: CC0603_4.7UF_16V_10%_X5R; Case: 0603; Mounted: Yes; Socket: No; SMD: Yes; Sense: No; Manufacturer1 Example: TAIYO YUDEN; Manufacturer1 ComponentHeight: 0.95mm; HelpURL: \\cern.ch\dfs\Applications\Altium\Datasheets\CC0603_X7R_TAIYO-YUDEN_HIGH-VALUE.pdf; Author: CERN DEM JLC; CreateDate: 2013-12-16; LatestRevisionDate: 2014-09-16
C27 C53 = CC0603_2.2UF_10V_20%_X7R: Non-polarised capacitor; Part Description: SMD Multilayer Chip Ceramic Capacitor; Manufacturer: GENERIC; Manufacturer1 Part Number: LMK107B7225MA-T; Voltage: 10V; TC: X7R; Tolerance: ±20%; Part Number: CC0603_2.2UF_10V_20%_X7R; Component Kind: Standard; Component Type: Standard; Pin Count: 2; Value: 2.2uF; Status: Not Recommended; Manufacturer Part Number: CC0603_2.2UF_10V_20%_X7R; Case: 0603; Mounted: Yes; Socket: No; SMD: Yes; Sense: No; Manufacturer1 Example: TAIYO YUDEN; Manufacturer1 ComponentHeight: 0.9mm; HelpURL: \\cern.ch\dfs\Applications\Altium\Datasheets\CC0603_X7R_TAIYO-YUDEN_HIGH-VALUE.pdf; Author: CERN DEM JLC; CreateDate: 2011-06-22; LatestRevisionDate: 2011-06-27
D5 D6 = 1PS76SB10: Schottky Diode; Part Description: Schottky Barrier Single Diode; Manufacturer: NXP SEMICONDUCTORS; Voltage: 30V; Power: 200mA; PressFit: No; Bonding: No; Part Number: 1PS76SB10; Component Kind: Standard; Component Type: Standard; Device: 1PS76SB10; PackageDescription: Small Outline Diode Flat Lead (SOD-323), 1.70mm W X 1.25mm L X 1.10mm H body,  IPC Medium Density; Manufacturer Part Number: 1PS76SB10; Pin Count: 2; Case: SOD323; Mounted: Yes; Socket: No; SMD: Yes; Sense: No; ComponentHeight: 1.1mm; HelpURL: \\cern.ch\dfs\Applications\Altium\Datasheets\1PS76SB10.pdf; Author: CERN DEM JLC; CreateDate: 2012-12-06; LatestRevisionDate: 2012-12-06
IC8 IC10 = LT3045EDD#PBF: 20V, 500mA, Ultralow Noise, Ultrahigh PSRR Linear Regulator; Manufacturer: LINEAR TECHNOLOGY; PressFit: No; Bonding: No; Part Number: LT3045EDD#PBF; Component Kind: Standard; Component Type: Standard; Device: LT3045EDD#PBF; PackageDescription: SON, 0.50mm Pitch, 10-pin, 3.00mm W  X 3.00mm L X 0.80mm Height, (w/thermal tab 1.75 X 2.48 mm), IPC Medium Density; Part Description: 20V, 500mA, Ultralow Noise, Ultrahigh PSRR Linear Regulator; Manufacturer Part Number: LT3045EDD#PBF; Pin Count: 11; Case: SON10; Mounted: Yes; Socket: No; SMD: Yes; Sense: No; ComponentHeight: 0.8mm; HelpURL: \\cern.ch\dfs\Applications\Altium\Datasheets\LT3045EDD#PBF.pdf; Author: CERN DEM JLC; CreateDate: 2016-12-07; LatestRevisionDate: 2016-12-07
IC9 = ADP7182AUJZ-5.0-R7: –5V, 200 mA, Low Noise, Linear Regulator; Part Description: –5V, -200mA, Low Noise, Linear Regulator; Manufacturer: ANALOG DEVICES; PressFit: No; Bonding: No; Part Number: ADP7182AUJZ-5.0-R7; Component Kind: Standard; Component Type: Standard; Device: ADP7182AUJZ-5.0-R7; PackageDescription: SOT23, 0.95mm pitch; 5 pin, 1.75mm W X 3.00mm L, IPC Medium Density; Manufacturer Part Number: ADP7182AUJZ-5.0-R7; Pin Count: 5; Case: SOT23-5; Mounted: Yes; Socket: No; SMD: Yes; Sense: No; ComponentHeight: 0.9mm; HelpURL: \\cern.ch\dfs\Applications\Altium\Datasheets\ADP7182AUJZ-5.0-R7.pdf; Author: CERN DEM JLC; CreateDate: 17.03.2014; LatestRevisionDate: 17.03.2014
L4 L9 L10 = IND0603_TDK_MPZ1608R391A: as L2 on sheet ADC_channel; Part Number: IND0603_TDK_MPZ1608R391A; Component Kind: Standard; Component Type: Standard; Pin Count: 2; Value: 390R@100MHz; Status: None; Manufacturer Part Number: MPZ1608R391A; Case: 0603; Mounted: Yes; Socket: No; SMD: Yes; Sense: No; ComponentHeight: 0.95mm; HelpURL: \\cern.ch\dfs\Applications\Altium\Datasheets\IND0603_TDK_MPZ1608.pdf; Author: CERN DEM JLC; CreateDate: 2009-12-02; LatestRevisionDate: 2009-12-02
R39 = R0603_49K9_0.1%_0.063W_10PPM: Resistor - 0.1%; Part Description: Thin Film Chip Resistor; Manufacturer: GENERIC; Manufacturer1 Part Number: RN73C1J49K9BTDF; Power: 0.063W; TC: ±10ppm; Part Number: R0603_49K9_0.1%_0.063W_10PPM; Component Kind: Standard; Component Type: Standard; Pin Count: 2; Value: 49k9; Status: Not recommended; Tolerance: ±0.1%; Manufacturer Part Number: R0603_49K9_0.1%_0.063W_10PPM; Case: 0603; Mounted: Yes; Sense: No; Socket: No; SMD: Yes; Manufacturer1 Example: TYCO HOLSWORTHY; Manufacturer1 ComponentHeight: 0.5mm; HelpURL: \\cern.ch\dfs\Applications\Altium\Datasheets\R0603_Tyco_RN73.pdf; Author: CERN DEM JLC; CreateDate: 2007-12-03; LatestRevisionDate: 2008-03-13
R60 = R0603_115K_0.1%_0.063W_10PPM: Resistor - 0.1%; Part Description: Thin Film Chip Resistor; Manufacturer: GENERIC; Manufacturer1 Part Number: RN73C1J115KBTDF; Power: 0.063W; TC: ±10ppm; Part Number: R0603_115K_0.1%_0.063W_10PPM; Component Kind: Standard; Component Type: Standard; Pin Count: 2; Value: 115k; Status: Not recommended; Tolerance: ±0.1%; Manufacturer Part Number: R0603_115K_0.1%_0.063W_10PPM; Case: 0603; Mounted: Yes; Sense: No; Socket: No; SMD: Yes; Manufacturer1 Example: TYCO HOLSWORTHY; Manufacturer1 ComponentHeight: 0.5mm; HelpURL: \\cern.ch\dfs\Applications\Altium\Datasheets\R0603_Tyco_RN73.pdf; Author: CERN DEM JLC; CreateDate: 2007-12-03; LatestRevisionDate: 2008-03-13

## Nets that join several sheets
ADC_VCM: ADC_channel (L2.1), B2B_connectors  (J13.33)
GND: ADC_channel (26 pins), B2B_connectors  (18 pins), PowerSupply (19 pins)
VCCN_5V0_A: ADC_channel (L5.1), PowerSupply (C53.2 D6.2 IC9.5)
VCCN_6V0_A: B2B_connectors  (J13.31), PowerSupply (L10.1)
VCCN_12V0_A: ADC_channel (6 pins), B2B_connectors  (J13.25)
VCCP_5V0: ADC_channel (L3.2), PowerSupply (C11.2 D5.1 IC8.9 IC8.10)
VCCP_6V0_A: B2B_connectors  (J13.32 J13.34), PowerSupply (L9.1)
VCCP_12V0_A: ADC_channel (5 pins), B2B_connectors  (J13.26), PowerSupply (L4.1)